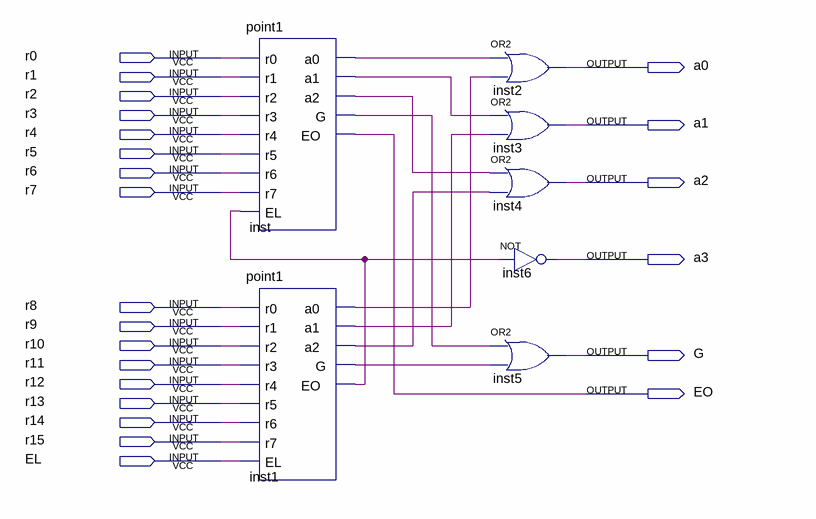
[diagram p0: schematic sheet]
// Quartus schematic point2.bdf as structural Verilog: 7 symbols, 23 pins
module point2 (
  input  r0,
  input  r1,
  input  r2,
  input  r3,
  input  r4,
  input  r5,
  input  r6,
  input  r7,
  input  r8,
  input  r9,
  input  r10,
  input  r11,
  input  r12,
  input  r13,
  input  r14,
  input  r15,
  input  EL,
  output a0,
  output a1,
  output a2,
  output a3,
  output G,
  output EO
);

  wire inst1_a0, inst1_a1, inst1_a2, inst1_eo, inst1_g, inst_a0, inst_a1, inst_a2, inst_g;

  point1 inst (
    .r0(r0), .r1(r1), .r2(r2), .r3(r3), .r4(r4), .r5(r5), .r6(r6), .r7(r7), .EL(inst1_eo), .a0(inst_a0),
    .a1(inst_a1), .a2(inst_a2), .G(inst_g), .EO(EO));
  point1 inst1 (
    .r0(r8), .r1(r9), .r2(r10), .r3(r11), .r4(r12), .r5(r13), .r6(r14), .r7(r15), .EL(EL), .a0(inst1_a0),
    .a1(inst1_a1), .a2(inst1_a2), .G(inst1_g), .EO(inst1_eo));
  or inst2 (a0, inst_a0, inst1_a0);
  or inst3 (a1, inst_a1, inst1_a1);
  or inst4 (a2, inst_a2, inst1_a2);
  not inst6 (a3, inst1_eo);
  or inst5 (G, inst_g, inst1_g);
endmodule
